# EAGLE design NN23_Det_Optode_02_OPA (EAGLE 7.7.0)
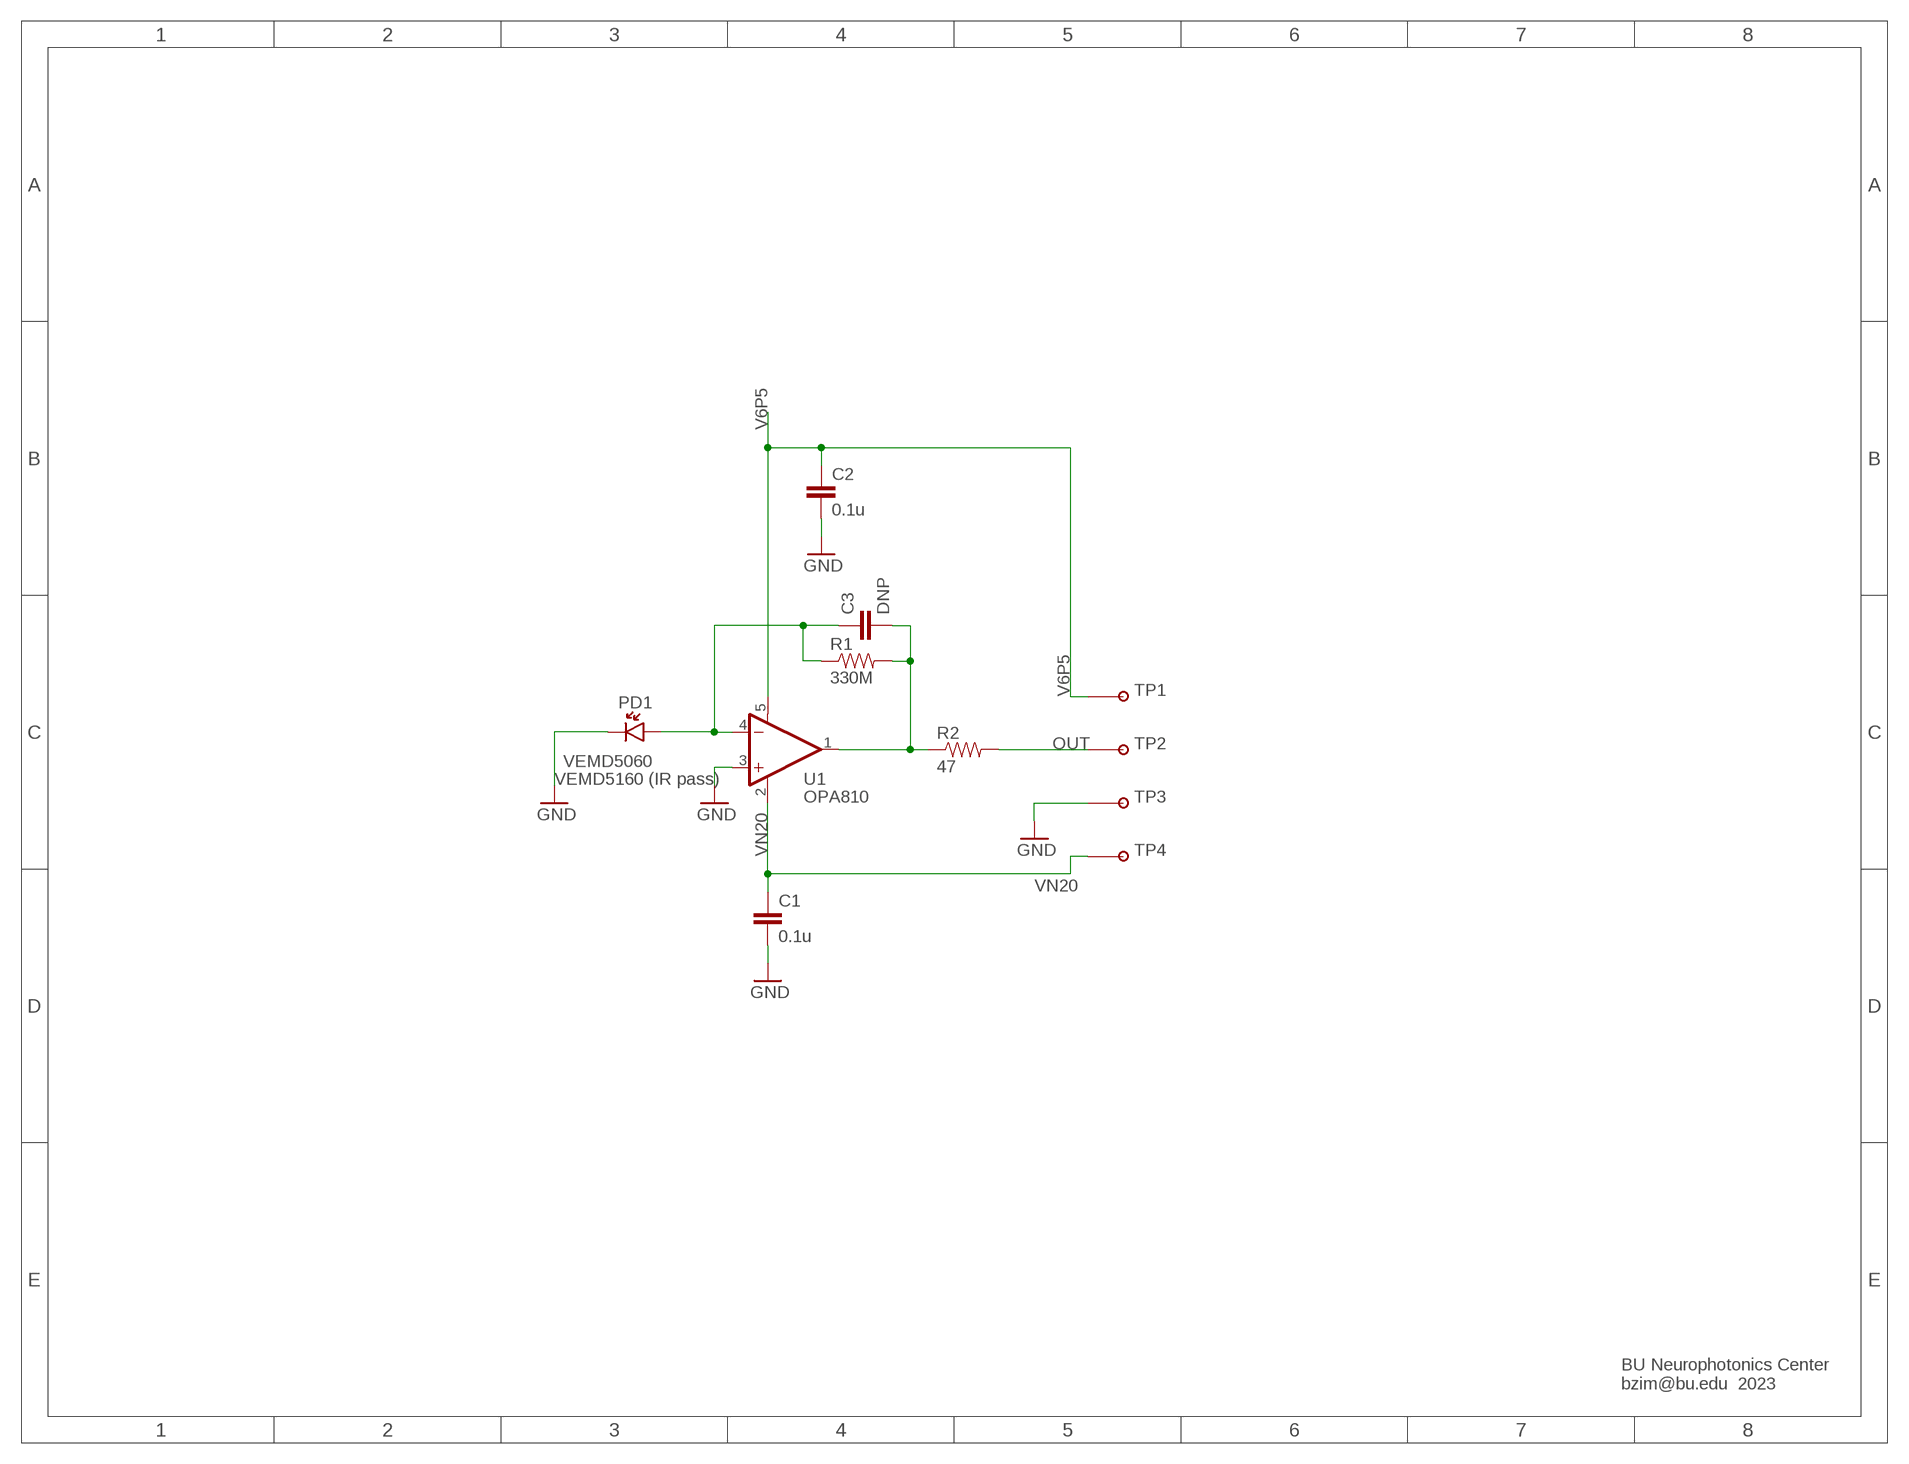
[diagram p0: schematic, sheet 1]

## Parts
C1  0.1u  CAP0402-CAP  [0402-CAP]
C2  0.1u  CAP0402-CAP  [0402-CAP]
C3  DNP  CAP0402-CAP  [0402-CAP]
PD1  VEMD5060  [VEMD5060]
R1  330M  RESISTOR0402-RES  [0402-RES]
R2  47  RESISTOR0402-RES  [0402-RES]
TP1  TESTPOINTPADSMALL  [TESTPAD_SMALL]
TP2  TESTPOINTPADSMALL  [TESTPAD_SMALL]
TP3  TESTPOINTPADSMALL  [TESTPAD_SMALL]
TP4  TESTPOINTPADSMALL  [TESTPAD_SMALL]
U1  OPA810  [SOT353]

## Nets
GND: C1.2 C2.2 PD1.C1(C) PD1.C2(C) TP3.P$1 U1.3(+IN)
N$4: C3.2 R1.2 R2.1 U1.1(OUT)
N$5: C3.1 PD1.A R1.1 U1.4(-IN)
OUT: R2.2 TP2.P$1
V6P5: C2.1 TP1.P$1 U1.5(V+)
VN20: C1.1 TP4.P$1 U1.2(V-)

## Notes on the sheet
- VEMD5160 (IR pass)
- BU Neurophotonics Center
  bzim@bu.edu  2023

## Library data of the parts
C1-C3 = MyLib:CAP: Capacitor Standard 0603 ceramic capacitor, and 0.1" leaded capacitor.
PD1 = MyLib:VEMD5060
R1 R2 = MyLib:RESISTOR: Resistor Basic schematic elements and footprints for 0603, 1206, and PTH resistors.
TP1-TP4 = MyLib:TESTPOINT
U1 = MyLib:OPA810: OP-AMP, FET input, 70MHz GBW

## Board
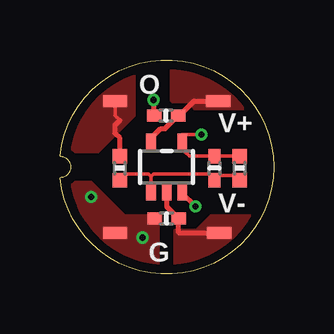
[diagram p1: board, top side]
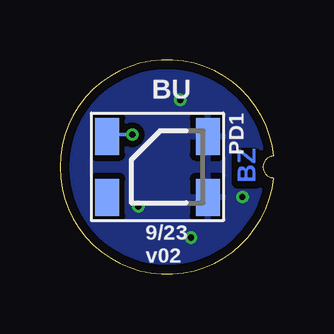
[diagram p2: board, bottom side, seen from below]

Size 8.92 x 8.93 mm. Coordinates in mm from the lower left corner, seen from the top.
Outline: 0,4.92 arc-348 0,4.02 arc180 0,4.92
Copper layers (1*16): Top 0.035559375mm / dielectric 1.6mm / Bottom 0.035559375mm
Design rules "oshpark-2layer": minimum track width 6mil, minimum drill 10mil, track to track 6mil, track to pad 6mil, pad to pad 6mil, via to via 6mil, smd to smd 6mil, copper to edge 15mil, drill to drill 6mil, minimum pad ring 5mil, minimum via ring 5mil, stop-mask expansion 2.5mil, vias tented up to drill 12mil, thermal gap 10mil

### Footprints (pad centres in the part's own frame; a part is rotated, then mirrored left to right if it is on the bottom)
0402-CAP = smd 0.6 x 0.5: 1 -0.5,0; 2 0.5,0
VEMD5060 = smd 1 x 1.55: A -2.1,1.275; C1 2.1,1.275; C2 2.1,-1.275; NC -2.1,-1.275
0402-RES = smd 0.6 x 0.6: 1 -0.5,0; 2 0.5,0
TESTPAD_SMALL = smd 1.016 x 0.508: P$1 0,0
SOT353 = smd 0.4 x 0.8: 1 -0.65,-1; 2 0,-1; 3 0.65,-1; 4 0.65,1; 5 -0.65,1

### Placement (x,y rotation side)
C1  4.45,2.32 180 top
C2  4.43,6.61 180 top
C3  6.45,4.42 270 top
PD1  4.85,4.47 0 bottom
R1  7.5,4.42 270 top
R2  2.5,4.42 90 top
TP1  6.6,7.22 180 top
TP2  2.3,7.22 0 top
TP3  2.3,1.72 180 top
TP4  6.65,1.72 180 top
U1  4.45,4.47 0 top

### Tracks (layer width: path | path; a pad name or v marks a point on that pad's centre or on a via)
GND  (via drill 0.25)
  Top 0.203: v5.65,2.82 5.1,3.37 U1.3 | C2.2 3.93,7.24 v3.9,7.27
  other vias: 1.3,3.22 3.45,1.52
  pour Bottom (isolate 0.254, rank 6): 0,0.02 9,0.02 9,9.02 0,9.02
  pour Top (no thermals): 0,3.82 1.3,3.82 2.7,2.42 4.1,2.42 4.1,0.02 0,0.02
N$4
  Top 0.152: U1.1 3.8,4.07 | 3.8,4.07 3.9,4.17 6.2,4.17 C3.2 6.6,4.12 7.2,4.12 R1.2 | 3.8,4.07 3.7,4.17 2.75,4.17 R2.1
N$5  (via drill 0.25)
  Top 0.152: v5.9,5.82 5.1,5.82 U1.4 5.2,5.37 5.2,5.12 5.4,4.92 C3.1 R1.1
  Bottom 0.152: PD1.A 6.95,5.77 6.9,5.82 v5.9,5.82
OUT
  Top 0.152: 2.5,6.42 2.3,6.62 TP2.P$1
  Top 0.203: R2.2 2.5,5.67 2.3,5.87 2.3,6.22 2.5,6.42
  pour Top (no thermals): 0,5.12 1.6,5.12 3.1,6.62 3.1,8.72 0,8.72
V6P5
  Top 0.203: U1.5 3.8,5.67 4.2,6.07 4.39,6.07 C2.1 4.99,6.61 5.6,7.22 TP1.P$1
  pour Top (no thermals): 4.7,7.22 4.7,8.92 8.1,8.92 8.1,6.92 5.65,6.92 5.35,7.22
VN20
  Top 0.203: U1.2 4.45,2.82 C1.1 | C1.1 5,2.32 | TP4.P$1 4.95,1.72 C1.1
  pour Top (no thermals): 4.8,1.82 5.7,1.82 6.3,2.42 8.4,2.42 8.4,0.02 4.8,0.02

### Text on the board
Bottom: BZ
tPlace: O | V+ | V- | G
bPlace: BU | 9/23 / v02